# Altium schematic sheet system_electric_diagram_#2.SchDoc
size A4
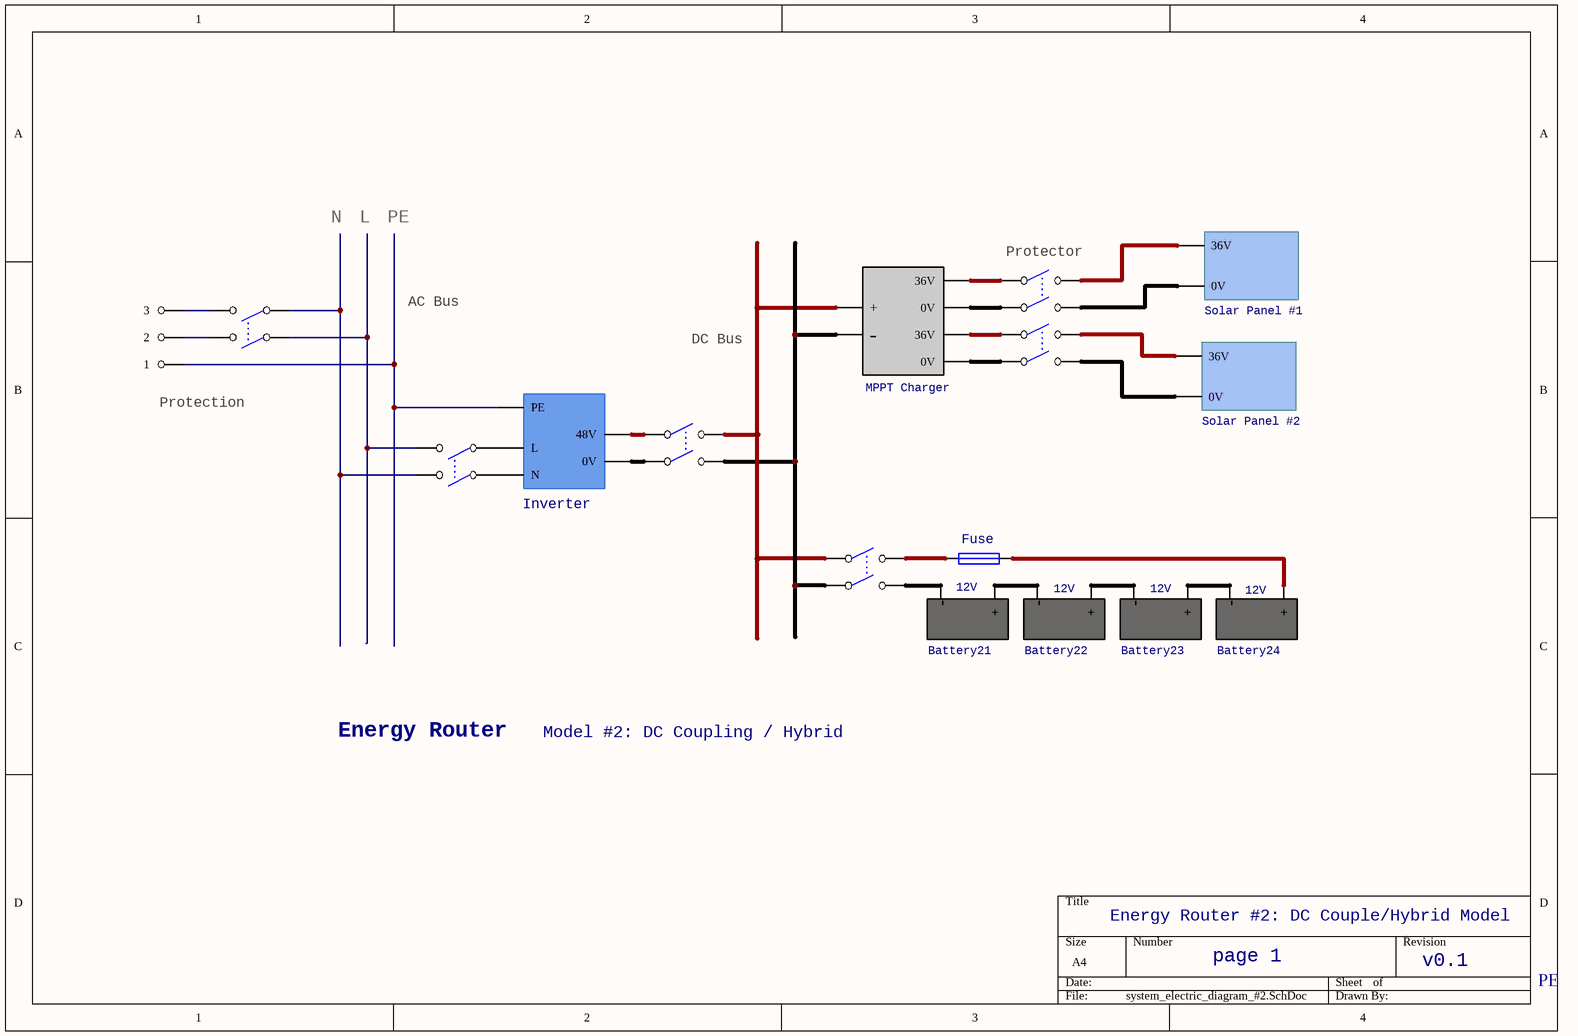
[diagram p0: system_electric_diagram_#2.SchDoc]

## Parts
Battery21  12V
Battery22  12V
Battery23  12V
Battery24  12V
F20  Fuse  [FUSE1]
JP201  3 HEADER  (value not drawn)
K201  Switch  (value not drawn)
K205  Switch  (value not drawn)
K206  Switch  (value not drawn)
K207  Switch  (value not drawn)
K210  Switch  (value not drawn)
K?  Switch  (value not drawn)
U201  MPPT Charger
U202  Inverter
U204  Solar Panel #1
U205  Solar Panel #2

## Nets
NetBattery21_1: Battery21.1(-) K210.4
NetBattery21_2: Battery21.2(+) Battery22.1(-)
NetBattery22_2: Battery22.2(+) Battery23.1(-)
NetBattery23_2: Battery23.2(+) Battery24.1(-)
NetBattery24_2: Battery24.2(+) F20.2
NetF20_1: F20.1 K210.2
NetJP201_1: JP201.1 U202.3(PE)
NetJP201_2: JP201.2 K201.2
NetJP201_3: JP201.3 K201.4
NetK201_1: K201.1 K?.4
NetK201_3: K201.3 K?.2
NetK205_1: K205.1 U201.7(36V)
NetK205_2: K205.2 U204.2(36V)
NetK205_3: K205.3 U201.6(0V)
NetK205_4: K205.4 U204.1(0V)
NetK206_1: K206.1 U201.5(36V)
NetK206_2: K206.2 U205.2(36V)
NetK206_3: K206.3 U201.4(0V)
NetK206_4: K206.4 U205.1(0V)
NetK207_1: K207.1 U202.5(48V)
NetK207_2: K207.2 K210.1 U201.2(+)
NetK207_3: K207.3 U202.4(0V)
NetK207_4: K207.4 K210.3 U201.1(-)
NetK?_1: K?.1 U202.1(N)
NetK?_3: K?.3 U202.2(L)

## Notes on the sheet
- N
- L
- PE
- AC Bus
- (near K205) Protector
- DC Bus
- (near JP201) Protection
- Energy Router
- Model #2: DC Coupling / Hybrid
- Energy Router #2: DC Couple/Hybrid Model
- page 1
- v0.1

## Library data of the parts
Battery21-Battery24 = 1_BAT_12V
JP201 = 3 HEADER: 3 Pin Header
K201 K205-K207 K210 K? = SW-DPST
U201 = 12_MPPT_Charger
U202 = 4_Inverter
U204 U205 = 10_Solar_Panel_36V